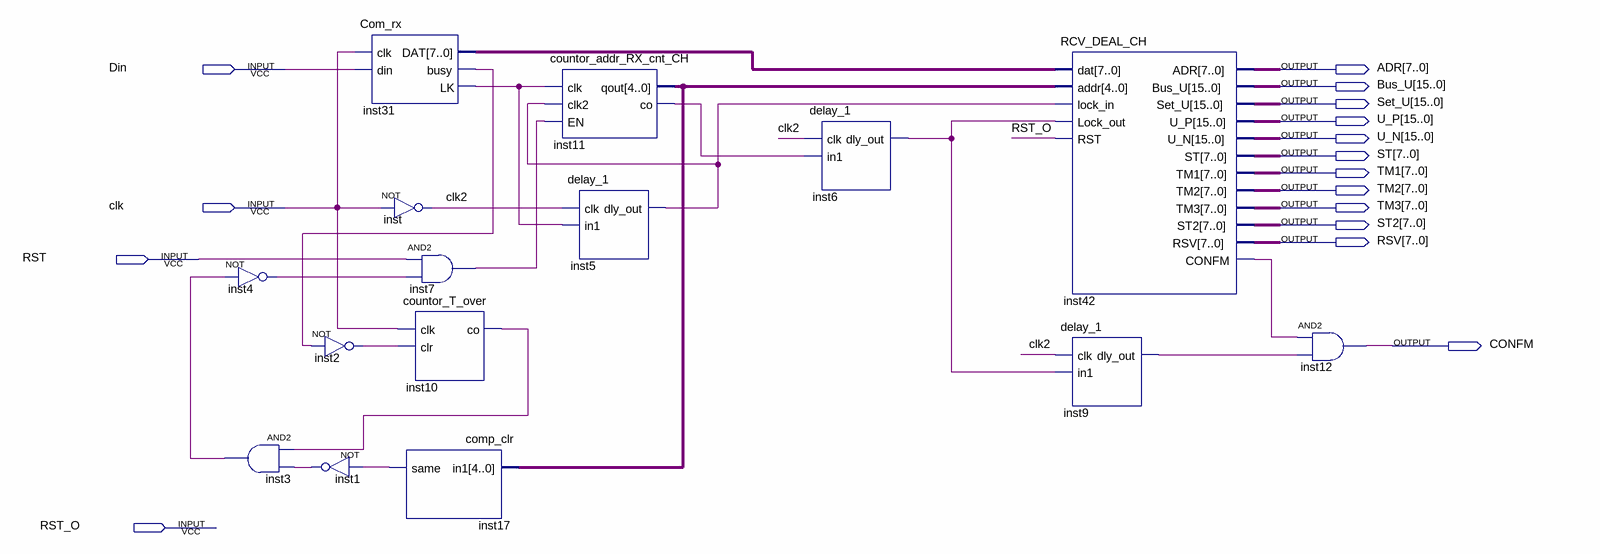
[diagram p0: schematic sheet]
// Quartus schematic Com_rx_charger.bdf as structural Verilog: 15 symbols, 16 pins
module Com_rx_charger (
  input  Din,
  input  clk,
  input  RST,
  input  RST_O,
  output [7:0] ADR,
  output [15:0] Bus_U,
  output [15:0] Set_U,
  output [15:0] U_P,
  output [15:0] U_N,
  output [7:0] ST,
  output [7:0] TM1,
  output [7:0] TM2,
  output [7:0] TM3,
  output [7:0] ST2,
  output [7:0] RSV,
  output CONFM
);

  wire clk2, inst1_out, inst2_out, inst3_out, inst4_out, inst5_dly_out, inst6_dly_out, inst7_out,
       inst9_dly_out, inst10_co, inst11_co, inst17_same, inst31_busy, inst31_lk, inst42_confm;
  wire [4:0] inst11_qout;
  wire [7:0] inst31_dat;

  not inst4 (inst4_out, inst3_out);
  and inst3 (inst3_out, inst10_co, inst1_out);
  Com_rx inst31 (.clk(clk), .din(Din), .DAT(inst31_dat), .busy(inst31_busy), .LK(inst31_lk));
  not inst2 (inst2_out, inst31_busy);
  not inst1 (inst1_out, inst17_same);
  not inst (clk2, clk);
  and inst7 (inst7_out, RST, inst4_out);
  countor_T_over inst10 (.clk(clk), .clr(inst2_out), .co(inst10_co));
  comp_clr inst17 (.in1(inst11_qout), .same(inst17_same));
  countor_addr_RX_cnt_CH inst11 (
    .clk(inst31_lk), .clk2(inst5_dly_out), .EN(inst7_out), .qout(inst11_qout), .co(inst11_co));
  delay_1 inst5 (.clk(clk2), .in1(inst31_lk), .dly_out(inst5_dly_out));
  delay_1 inst6 (.clk(clk2), .in1(inst11_co), .dly_out(inst6_dly_out));
  RCV_DEAL_CH inst42 (
    .dat(inst31_dat), .addr(inst11_qout), .lock_in(inst5_dly_out), .Lock_out(inst6_dly_out), .RST(RST_O),
    .ADR(ADR), .Bus_U(Bus_U), .Set_U(Set_U), .U_P(U_P), .U_N(U_N), .ST(ST), .TM1(TM1), .TM2(TM2), .TM3(TM3),
    .ST2(ST2), .RSV(RSV), .CONFM(inst42_confm));
  delay_1 inst9 (.clk(clk2), .in1(inst6_dly_out), .dly_out(inst9_dly_out));
  and inst12 (CONFM, inst42_confm, inst9_dly_out);
endmodule
